# EAGLE design shield_007 (EAGLE 7.3.0)
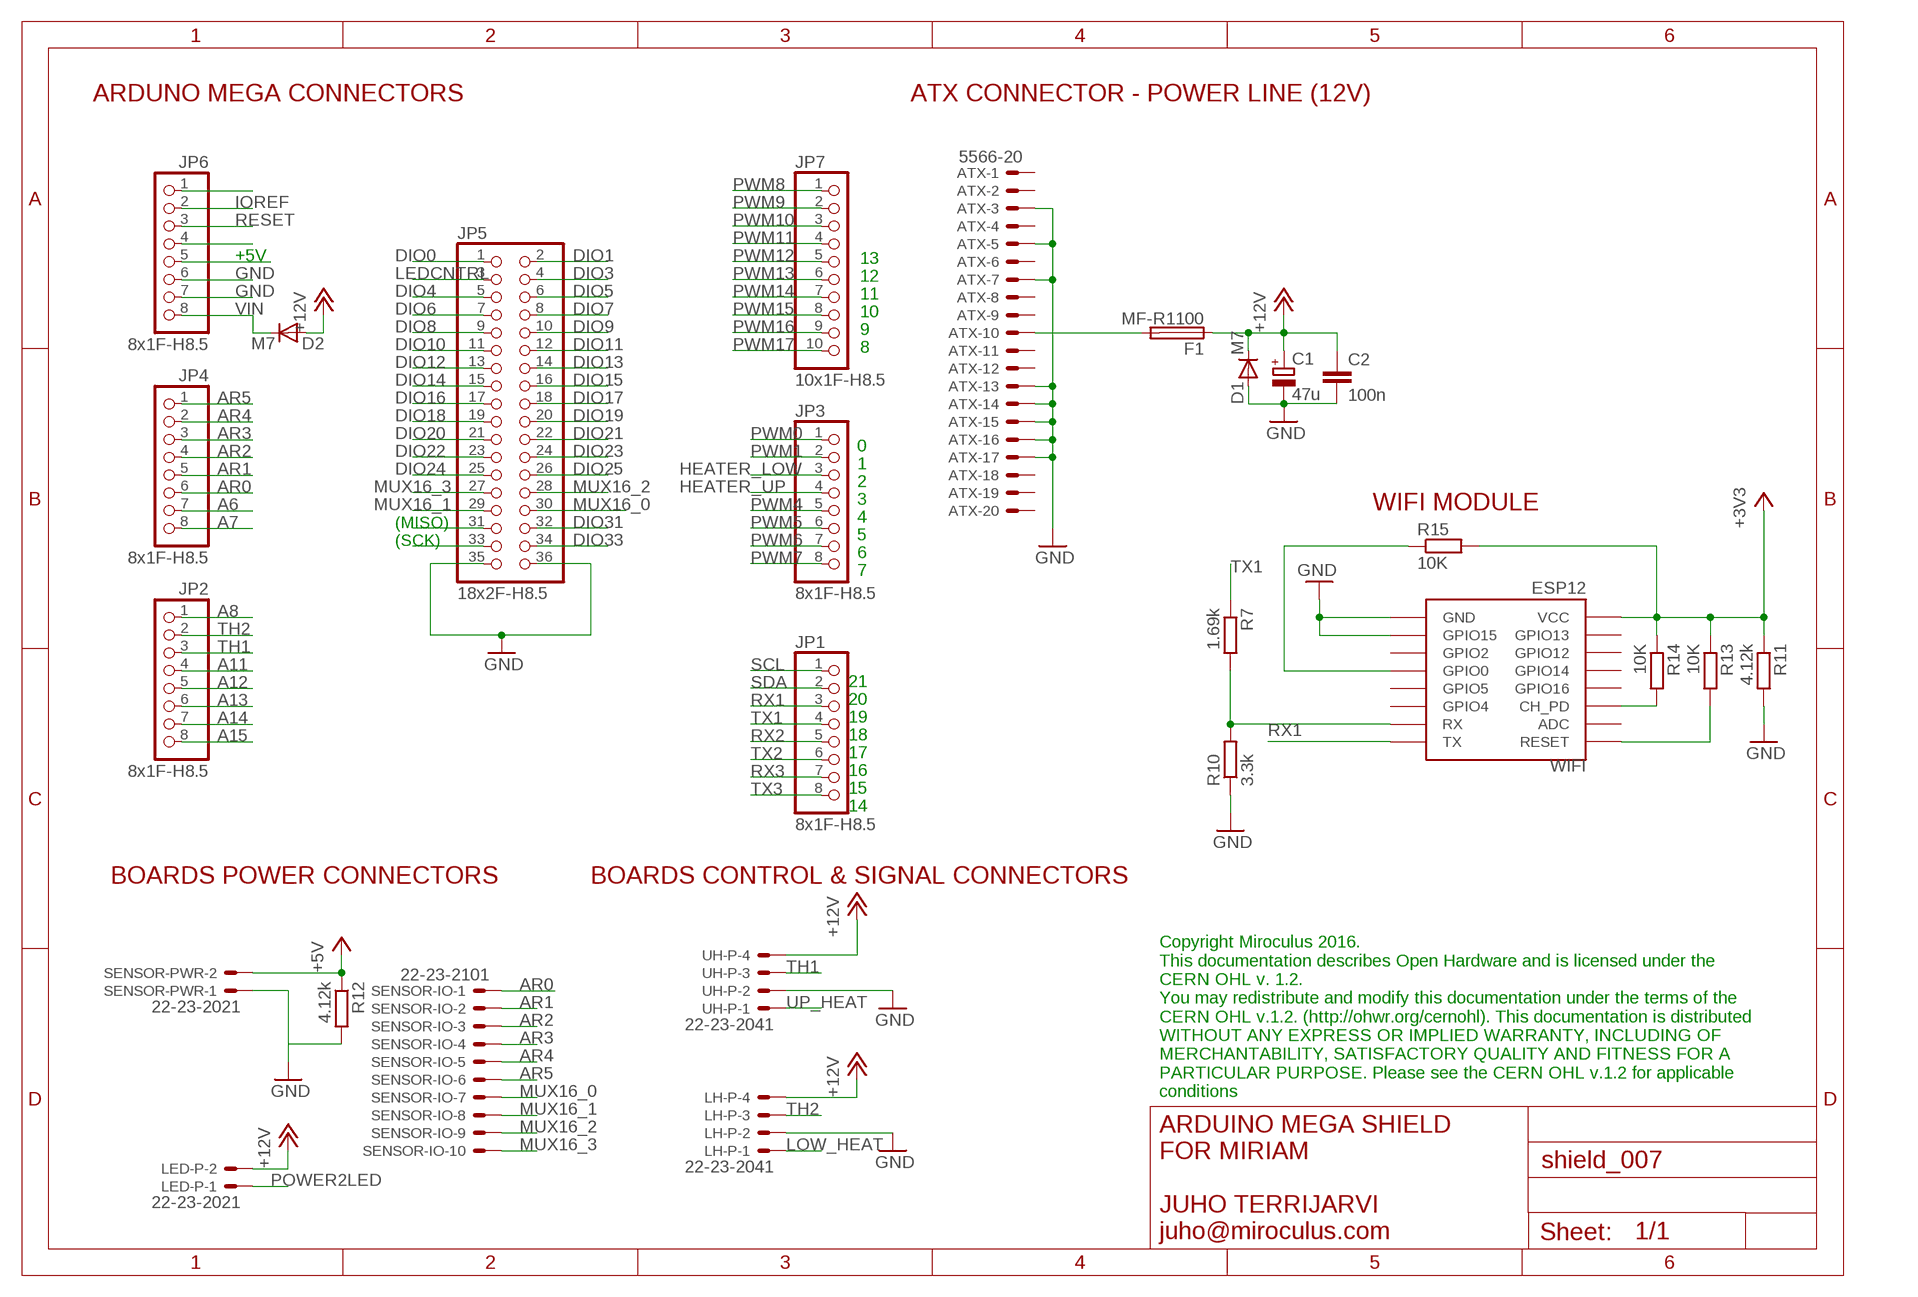
[diagram p0: schematic, sheet 1, part 1 of 2]
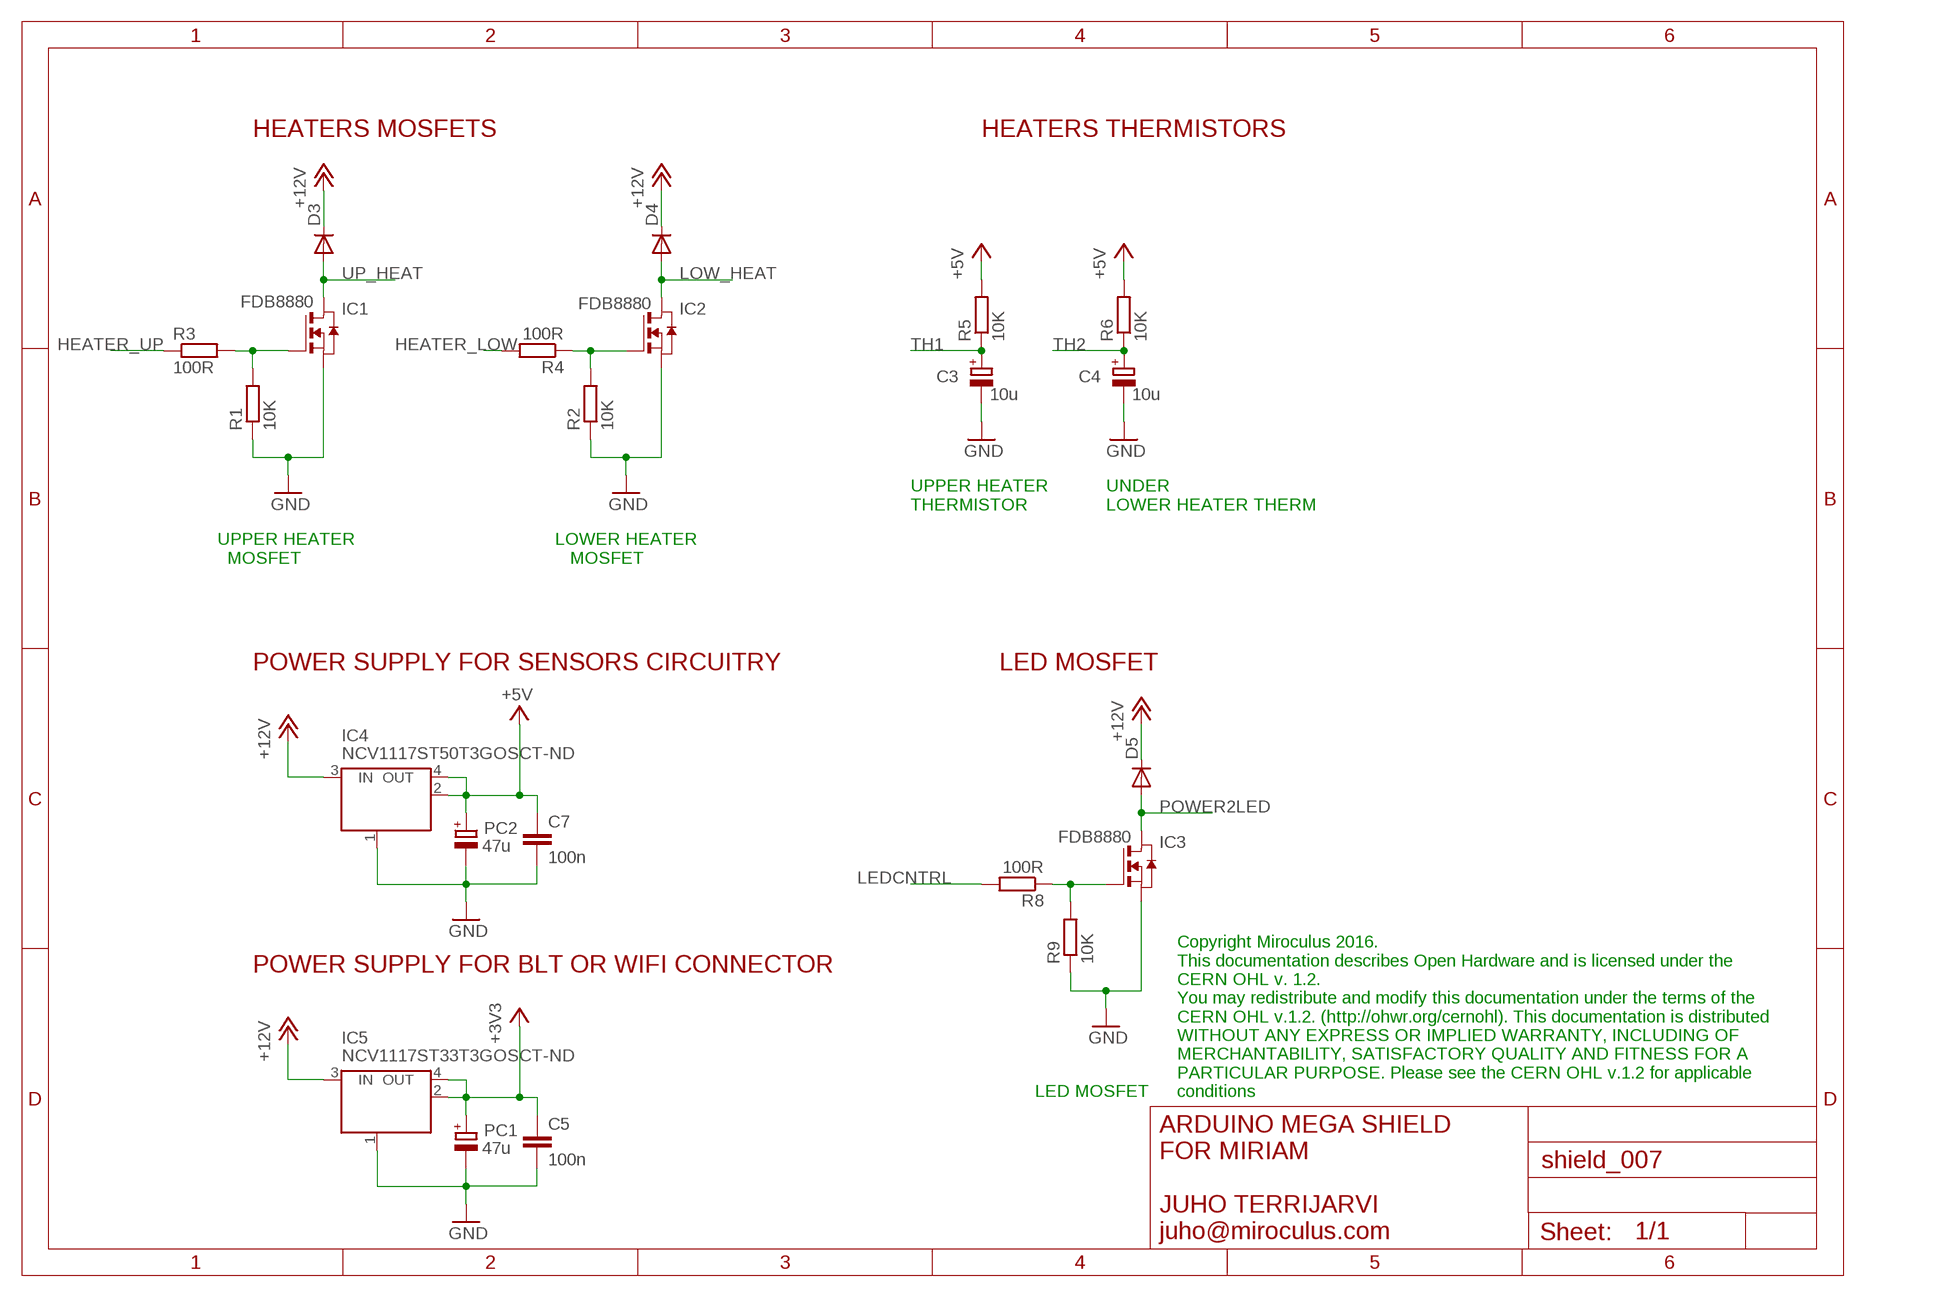
[diagram p1: schematic, sheet 1, part 2 of 2]

## Parts
ATX  5566-20  [5566-20]
C1  47u  CPOL-EUD  [PANASONIC_D]
C2  100n  C-EUC0603  [C0603]
C3  10u  CPOL-EUA/3216-18R  [A/3216-18R]
C4  10u  CPOL-EUA/3216-18R  [A/3216-18R]
C5  100n  C-EUC0603  [C0603]
C7  100n  C-EUC0603  [C0603]
D1  M7  DIODE-SMB  [SMB]
D2  M7  DIODE-SMB  [SMB]
D3  RGL34A  DO-213_DIODE  [DO-213AA_DIODE]
D4  RGL34A  DO-213_DIODE  [DO-213AA_DIODE]
D5  RGL34A  DO-213_DIODE  [DO-213AA_DIODE]
F1  MF-R1100  LITTLEFUSE  [LITTLEFUSE]
IC1  FDB8880  [FDB8880]
IC2  FDB8880  [FDB8880]
IC3  FDB8880  [FDB8880]
IC4  NCV1117ST50T3GOSCT-ND  MC33269ST-3.3T3  [SOT223]
IC5  NCV1117ST33T3GOSCT-ND  MC33269ST-3.3T3  [SOT223]
JP1  8x1F-H8.5  PINHD-1X8  [1X08]
JP2  8x1F-H8.5  PINHD-1X8  [1X08]
JP3  8x1F-H8.5  PINHD-1X8  [1X08]
JP4  8x1F-H8.5  PINHD-1X8  [1X08]
JP5  18x2F-H8.5  PINHD-2X18  [2X18]
JP6  8x1F-H8.5  PINHD-1X8  [1X08]
JP7  10x1F-H8.5  PINHD-1X10_ARD  [1X10]
LED-P  22-23-2021  [22-23-2021]
LH-P  22-23-2041  [22-23-2041]
PC1  47u  CPOL-EUD  [PANASONIC_D]
PC2  47u  CPOL-EUD  [PANASONIC_D]
R1  10K  R-EU_R0603  [R0603]
R2  10K  R-EU_R0603  [R0603]
R3  100R  R-EU_R0603  [R0603]
R4  100R  R-EU_R0603  [R0603]
R5  10K  R-EU_R0603  [R0603]
R6  10K  R-EU_R0603  [R0603]
R7  1.69k  R-EU_R0603  [R0603]
R8  100R  R-EU_R0603  [R0603]
R9  10K  R-EU_R0603  [R0603]
R10  3.3k  R-EU_R0603  [R0603]
R11  4.12k  R-EU_R0603  [R0603]
R12  4.12k  R-EU_R0603  [R0603]
R13  10K  R-EU_R0603  [R0603]
R14  10K  R-EU_R0603  [R0603]
R15  10K  R-EU_R0603  [R0603]
SENSOR-IO  22-23-2101  [22-23-2101]
SENSOR-PWR  22-23-2021  [22-23-2021]
UH-P  22-23-2041  [22-23-2041]
WIFI  ESP12  [ESP12]

## Nets
+3V3 [power usb]: C5.1 IC5.2(OUT) IC5.4(OUT) PC1.+ R11.1 R13.1 R14.1 R15.2 WIFI.VCC
+5V: C7.1 IC4.2(OUT) IC4.4(OUT) PC2.+ R5.2 R6.2 R12.1 SENSOR-PWR.2
+12V [power12]: C1.+ C2.1 D1.C D2.A D3.P$2(C) D4.P$2(C) D5.P$2(C) F1.1 IC4.3(IN) IC5.3(IN) LED-P.2 LH-P.4 UH-P.4
A6: JP4.7
A7: JP4.8
A8: JP2.1
A11: JP2.4
A12: JP2.5
A13: JP2.6
A14: JP2.7
A15: JP2.8
AR0: JP4.6 SENSOR-IO.1
AR1: JP4.5 SENSOR-IO.2
AR2: JP4.4 SENSOR-IO.3
AR3: JP4.3 SENSOR-IO.4
AR4: JP4.2 SENSOR-IO.5
AR5: JP4.1 SENSOR-IO.6
DIO0: JP5.1
DIO1: JP5.2
DIO3: JP5.4
DIO4: JP5.5
DIO5: JP5.6
DIO6: JP5.7
DIO7: JP5.8
DIO8: JP5.9
DIO9: JP5.10
DIO10: JP5.11
DIO11: JP5.12
DIO12: JP5.13
DIO13: JP5.14
DIO14: JP5.15
DIO15: JP5.16
DIO16: JP5.17
DIO17: JP5.18
DIO18: JP5.19
DIO19: JP5.20
DIO20: JP5.21
DIO21: JP5.22
DIO22: JP5.23
DIO23: JP5.24
DIO24: JP5.25
DIO25: JP5.26
DIO30: JP5.31
DIO31: JP5.32
DIO32: JP5.33
DIO33: JP5.34
GND [gnd]: ATX.3 ATX.5 ATX.7 ATX.13 ATX.14 ATX.15 ATX.16 ATX.17 C1.- C2.2 C3.- C4.- C5.2 C7.2 D1.A IC1.3(S) IC2.3(S) IC3.3(S) IC4.1(GND/ADJ) IC5.1(GND/ADJ) JP5.35 JP5.36 JP6.6 JP6.7 LH-P.2 PC1.- PC2.- R1.1 R2.1 R9.1 R10.1 R11.2 R12.2 SENSOR-PWR.1 UH-P.2 WIFI.GND WIFI.GPIO15
HEATER_LOW: JP3.3 R4.2
HEATER_UP: JP3.4 R3.1
IOREF: JP6.2
LEDCNTRL: JP5.3 R8.2
LOW_HEAT [power12]: D4.P$1(A) IC2.2(D) LH-P.1
MUX16_0: JP5.30 SENSOR-IO.7
MUX16_1: JP5.29 SENSOR-IO.8
MUX16_2: JP5.28 SENSOR-IO.9
MUX16_3: JP5.27 SENSOR-IO.10
N$1: JP6.1
N$2: JP6.5
N$4: IC3.1(G) R8.1 R9.2
N$5: R7.2 R10.2 WIFI.RX
N$6: JP6.4
N$10: R13.2 WIFI.RESET
N$11 [power usb]: R14.2 WIFI.CH_PD
N$13: R15.1 WIFI.GPIO0
N$17 [power12]: ATX.10 F1.2
N$18: IC1.1(G) R1.2 R3.2
N$19: IC2.1(G) R2.2 R4.1
POWER2LED [power12]: D5.P$1(A) IC3.2(D) LED-P.1
PWM0: JP3.1
PWM1: JP3.2
PWM4: JP3.5
PWM5: JP3.6
PWM6: JP3.7
PWM7: JP3.8
PWM8: JP7.1
PWM9: JP7.2
PWM10: JP7.3
PWM11: JP7.4
PWM12: JP7.5
PWM13: JP7.6
PWM14: JP7.7
PWM15: JP7.8
PWM16: JP7.9
PWM17: JP7.10
RESET: JP6.3
RX1: JP1.3 WIFI.TX
RX2: JP1.5
RX3: JP1.7
SCL: JP1.1
SDA: JP1.2
TH1: C3.+ JP2.3 R5.1 UH-P.3
TH2: C4.+ JP2.2 LH-P.3 R6.1
TX1: JP1.4 R7.1
TX2: JP1.6
TX3: JP1.8
UP_HEAT [power12]: D3.P$1(A) IC1.2(D) UH-P.1
VIN: D2.C JP6.8
Unconnected: ATX.1 ATX.2 ATX.4 ATX.6 ATX.8 ATX.9 ATX.11 ATX.12 ATX.18 ATX.19 ATX.20 WIFI.ADC WIFI.GPIO2 WIFI.GPIO4 WIFI.GPIO5 WIFI.GPIO12 WIFI.GPIO13 WIFI.GPIO14 WIFI.GPIO16

## Notes on the sheet
- ARDUNO MEGA CONNECTORS | ATX CONNECTOR - POWER LINE (12V)
- HEATERS MOSFETS | HEATERS THERMISTORS
- +5V | 13
- 12
- 11
- 10
- 9
- 8
- 0
- 1
- 2
- 3
- 4 | WIFI MODULE
- UPPER HEATER
  THERMISTOR
- UNDER
  LOWER HEATER THERM
- (MISO) | 5
- (SCK) | 6
- 7
- UPPER HEATER
    MOSFET
- LOWER HEATER
     MOSFET
- 21 | POWER SUPPLY FOR SENSORS CIRCUITRY | LED MOSFET
- 20
- 19
- 18
- 17
- 16
- 15
- 14
- BOARDS POWER CONNECTORS | BOARDS CONTROL & SIGNAL CONNECTORS
- POWER SUPPLY FOR BLT OR WIFI CONNECTOR
- Copyright Miroculus 2016.
  This documentation describes Open Hardware and is licensed under the
  CERN OHL v. 1.2.
  You may redistribute and modify this documentation under the terms of the
  CERN OHL v.1.2. (http://ohwr.org/cernohl). This documentation is distributed
  WITHOUT ANY EXPRESS OR IMPLIED WARRANTY, INCLUDING OF
  MERCHANTABILITY, SATISFACTORY QUALITY AND FITNESS FOR A
  PARTICULAR PURPOSE. Please see the CERN OHL v.1.2 for applicable
  conditions
- LED MOSFET
- Copyright Miroculus 2016.
  This documentation describes Open Hardware and is licensed under the
  CERN OHL v. 1.2.
  You may redistribute and modify this documentation under the terms of the
  CERN OHL v.1.2. (http://ohwr.org/cernohl). This documentation is distributed
  WITHOUT ANY EXPRESS OR IMPLIED WARRANTY, INCLUDING OF
  MERCHANTABILITY, SATISFACTORY QUALITY AND FITNESS FOR A
  PARTICULAR PURPOSE. Please see the CERN OHL v.1.2 for applicable
  conditions
- ARDUINO MEGA SHIELD
  FOR MIRIAM
  
  JUHO TERRIJARVI
  juho@miroculus.com
- ARDUINO MEGA SHIELD
  FOR MIRIAM
  
  JUHO TERRIJARVI
  juho@miroculus.com

## Library data of the parts
ATX = con-molex:5566-20: Mini FIT connector 20 pol ATX PC-Motherboard Power connector Source: http://www.molex.com; OC_FARNELL: 9734252; OC_NEWARK: unknown
C1 C3 C4 PC1 PC2 = rcl:CPOL-EU: POLARIZED CAPACITOR, European symbol
C2 C5 C7 = rcl:C-EU: CAPACITOR, European symbol
D1 D2 = diode:DIODE-: DIODE
D3-D5 = verkstad:DO-213_DIODE: RGL34A thru RGL34K Surface Mount Glass Passivated Junction Fast Switching Rectifier
F1 = fuse:LITTLEFUSE: LITTLEFUSE Picofuse/slow Littlefuse; FARNELL: 1652183; OC_FARNELL: unknown; OC_NEWARK: unknown
IC1-IC3 = verkstad:FDB8880: FDB8880 N-Channel PowerTrench MOSFET This N-Channel MOSFET has been designed specifically to improve the overall efficiency of DC/DC converters using either synchronous or conventional switching PWM controllers. It has been optimized for low gate charge, low rDS(ON) and fast switching speed. Digikey Part Number: FDD8880CT-ND
IC4 IC5 = linear:MC33269ST*: Adjustable Output Low Dropout Voltage Regulator 800 mA Source: http://www.onsemi.com/pub/Collateral/MC33269-D.PDF
JP1-JP4 JP6 = SmartPrj:PINHD-1X8: PIN HEADER
JP5 = SmartPrj:PINHD-2X18: PIN HEADER
JP7 = SmartPrj:PINHD-1X10_ARD: PIN HEADER
LED-P SENSOR-PWR = con-molex:22-23-2021: .100" (2.54mm) Center Header - 2 Pin; MF: MOLEX; MPN: 22-23-2021; OC_FARNELL: 1462926; OC_NEWARK: 25C3832
LH-P UH-P = con-molex:22-23-2041: .100" (2.54mm) Center Header - 4 Pin; MF: MOLEX; MPN: 22-23-2041; OC_FARNELL: 1462920; OC_NEWARK: 38C0355
R1-R15 = rcl:R-EU_: RESISTOR, European symbol
SENSOR-IO = con-molex:22-23-2101: .100" (2.54mm) Center Header - 10 Pin; MF: MOLEX; MPN: 22-23-2101; OC_FARNELL: 1756828; OC_NEWARK: 94C0765
WIFI = esp8266modules:ESP12: ESP8266 Wifi module 12

## Net classes
0 default: width 0.254 mm, drill 0.406 mm, clearance 0.203 mm
1 power: width 0.61 mm, drill 0.406 mm, clearance 0.203 mm
2 gnd: width 0.305 mm, drill 0.406 mm, clearance 0.203 mm
3 power usb: width 0.508 mm, drill 0.406 mm, clearance 0.203 mm
4 power12: width 1.905 mm, drill 0.813 mm, clearance 0.203 mm

## Board
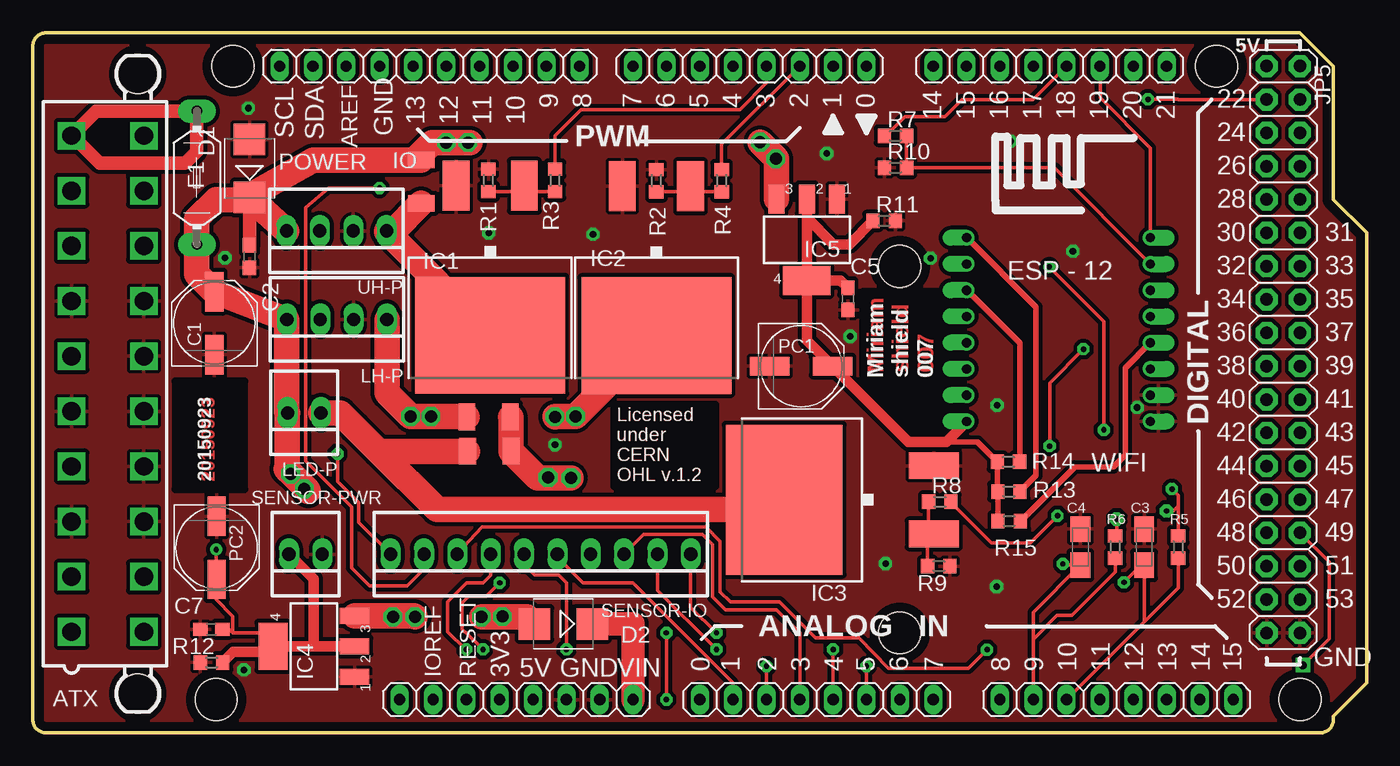
[diagram p2: board, top side]
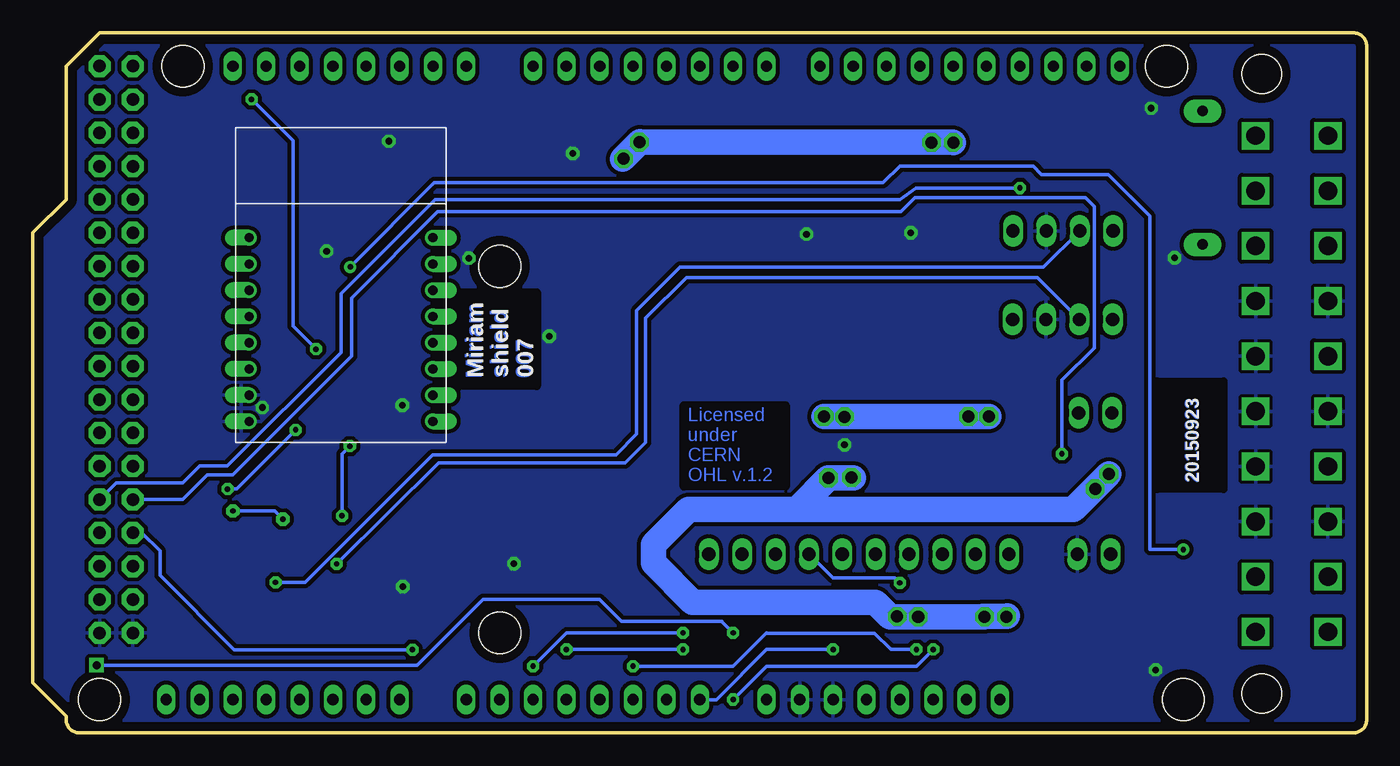
[diagram p3: board, bottom side, seen from below]

Size 101.6 x 53.34 mm. Coordinates in mm from the lower left corner, seen from the top.
Outline: 96.52,53.34 99.06,50.8 99.06,40.64 101.6,38.1 101.6,3.81 99.06,1.27 99.06,1 arc-90 98.06,0 1,0 arc-90 0,1 0,52.34 arc-90 1,53.34 96.52,53.34
Copper layers (1*16): Top 0.035mm / dielectric 1.5mm / Bottom 0.035mm
Design rules "default": minimum track width 8mil, minimum drill 16mil, track to track 7mil, track to pad 7mil, pad to pad 8mil, via to via 10mil, smd to smd 7mil, copper to edge 27mil, drill to drill 12mil, minimum pad ring 10mil, minimum via ring 10mil, stop-mask expansion 2mil, vias tented up to drill 24mil, thermal gap 10mil
Holes 3.2 mm at 96.52,2.54 15.24,50.8 90.17,50.8 13.97,2.54 66.04,35.56 66.04,7.62
tRestrict: area 10.9,18.6 to 16.1,26.8; area 63.2,26.5 to 69.1,33.6; area 44.3,18.8 to 52,25
bRestrict: area 10.9,18.6 to 16,26.8; area 63.2,26.4 to 69.1,33.6; area 44.2,18.8 to 52,25

### Footprints (pad centres in the part's own frame; a part is rotated, then mirrored left to right if it is on the bottom)
5566-20 = drill 1.4 square: 1 18.9,-2.75; 2 14.7,-2.75; 3 10.5,-2.75; 4 6.3,-2.75; 5 2.1,-2.75; 6 -2.1,-2.75; 7 -6.3,-2.75; 8 -10.5,-2.75; 9 -14.7,-2.75; 10 -18.9,-2.75; 11 18.9,2.75; 12 14.7,2.75; 13 10.5,2.75; 14 6.3,2.75; 15 2.1,2.75; 16 -2.1,2.75; 17 -6.3,2.75; 18 -10.5,2.75; 19 -14.7,2.75; 20 -18.9,2.75 | hole 3: 23.6,2.29; -23.6,2.29
PANASONIC_D = smd 3 x 1.4: + 2.4,0; - -2.4,0
C0603 = smd 1.1 x 1: 1 -0.85,0; 2 0.85,0
A/3216-18R = smd 1.95 x 1.5: + 1.375,0; - -1.375,0
SMB = smd 2.4 x 2.4: A 2.2,0; C -2.2,0
DO-213AA_DIODE = smd 1.27 x 2.032: P$1 -1.651,0; P$2 1.651,0
LITTLEFUSE = drill 0.813 pad 1.778 long: 1 -5.08,0; 2 5.08,0
FDB8880 = smd 2.032 x 3.81: 1 -2.595,-8.89; 3 2.595,-8.89 | smd 11.43 x 8.89: 2 0,2.5
SOT223 = smd 1.219 x 2.235: 1 -2.311,-3.099; 2 0,-3.099; 3 2.311,-3.099 | smd 3.6 x 2.2: 4 0,3.099
1X08 = drill 0.85 pad 1.422 long: 1 -8.89,0; 2 -6.35,0; 3 -3.81,0; 4 -1.27,0; 5 1.27,0; 6 3.81,0; 7 6.35,0; 8 8.89,0
2X18 = drill 0.95 pad 1.676 octagon: 1 -21.59,-1.27; 2 -21.59,1.27; 3 -19.05,-1.27; 4 -19.05,1.27; 5 -16.51,-1.27; 6 -16.51,1.27; 7 -13.97,-1.27; 8 -13.97,1.27; 9 -11.43,-1.27; 10 -11.43,1.27; 11 -8.89,-1.27; 12 -8.89,1.27; 13 -6.35,-1.27; 14 -6.35,1.27; 15 -3.81,-1.27; 16 -3.81,1.27; 17 -1.27,-1.27; 18 -1.27,1.27; 19 1.27,-1.27; 20 1.27,1.27; 21 3.81,-1.27; 22 3.81,1.27; 23 6.35,-1.27; 24 6.35,1.27; 25 8.89,-1.27; 26 8.89,1.27; 27 11.43,-1.27; 28 11.43,1.27; 29 13.97,-1.27; 30 13.97,1.27; 31 16.51,-1.27; 32 16.51,1.27; 33 19.05,-1.27; 34 19.05,1.27; 35 21.59,-1.27; 36 21.59,1.27
1X10 = drill 0.85 pad 1.422 long: 1 -11.43,0; 2 -8.89,0; 3 -6.35,0; 4 -3.81,0; 5 -1.27,0; 6 1.27,0; 7 3.81,0; 8 6.35,0; 9 8.89,0; 10 11.43,0
22-23-2021 = drill 1 long: 1 -1.27,0; 2 1.27,0
22-23-2041 = drill 1 long: 1 -3.81,0; 2 -1.27,0; 3 1.27,0; 4 3.81,0
R0603 = smd 1 x 1.1: 1 -0.85,0; 2 0.85,0
22-23-2101 = drill 1 long: 1 -11.43,0; 2 -8.89,0; 3 -6.35,0; 4 -3.81,0; 5 -1.27,0; 6 1.27,0; 7 3.81,0; 8 6.35,0; 9 8.89,0; 10 11.43,0
ESP12 = drill 0.7 offset: ADC -7.1,3.8; CH_PD -7.1,1.8; GND 6.9,-8.2; GPIO0 6.9,-2.2; GPIO2 6.9,-4.2; GPIO4 6.9,1.8; GPIO5 6.9,-0.2; GPIO12 -7.1,-4.2; GPIO13 -7.1,-6.2; GPIO14 -7.1,-2.2; GPIO15 6.9,-6.2; GPIO16 -7.1,-0.2; RESET -7.1,5.8; RX 6.9,3.8; TX 6.9,5.8; VCC -7.1,-8.2

### Placement (x,y rotation side)
ATX  5.7,26.6 270 top
C1  13.83,31.22 90 top
C2  16.5,36.3 270 top
C3  84.65,14.16 270 top
C4  79.79,14.16 270 top
C5  62.08,33.07 270 top
C7  13.6,7.9 180 top
D1  16.5,43 90 top
D2  40.4,8.3 180 top
D3  29.59,42 90 top
D4  34.72,24.06 0 top
D5  34.77,21.46 0 top
F1  12.5,42.3 90 top
IC1  34.84,32.79 180 top
IC2  47.5,32.77 180 top
IC3  59.74,17.76 90 top
IC4  21.4,6.6 90 top
IC5  58.95,37.57 180 top
JP1  77.47,50.8 180 top
JP2  82.55,2.54 0 top
JP3  54.61,50.8 180 top
JP4  59.69,2.54 0 top
JP5  95.25,29.21 270 top
JP6  36.83,2.54 0 top
JP7  30.23,50.8 0 top
LED-P  20.67,24.38 180 top
LH-P  23.16,31.5 180 top
PC1  58.52,27.94 0 top
PC2  14,14.1 270 top
R1  34.71,42.1 270 top
R2  47.5,42.07 270 top
R3  39.78,42.1 270 top
R4  52.47,42.07 90 top
R5  87.25,14.16 90 top
R6  82.44,14.16 90 top
R7  65.71,45.49 0 top
R8  69.09,17.6 0 top
R9  69.01,12.7 180 top
R10  65.71,43.05 0 top
R11  64.85,39.01 0 top
R12  13.61,5.36 180 top
R13  74.35,18.39 0 top
R14  74.32,20.65 0 top
R15  74.37,16.13 180 top
SENSOR-IO  38.68,13.62 180 top
SENSOR-PWR  20.78,13.61 180 top
UH-P  23.13,38.25 180 top
WIFI  78.23,31.93 0 top

### Tracks (layer width: path | path; a pad name or v marks a point on that pad's centre or on a via)
+3V3
  Top 0.406: 68.71,22.17 71.95,22.17 R14.1 73.47,18.41 R13.1 73.5,16.15 R15.2
  Top 0.813: IC5.2 58.95,39.24 | 58.95,39.24 IC5.4 | IC5.4 61.53,34.47 C5.1 | IC5.4 58.95,29.91 PC1.+ 66.69,22.17 68.71,22.17 69.58,22.17 WIFI.VCC | R11.1 62.19,37.21 60.98,37.21 58.95,39.24
+5V  (via drill 0.41, 0.41 pad 1.02)
  Top 0.203: 13.97,11.43 PC2.+
  Top 0.254: 13.97,11.43 13.97,10.16 15.24,8.89 15.24,7.62 | 19.05,5.08 17.78,5.08 17.78,6.17 17.78,6.35 IC4.4 17.78,7.62 15.24,7.62 | 24.13,6.35 IC4.2 | v13.97,13.97 13.97,12.06 PC2.+ | 15.24,7.62 14.96,7.9 C7.1 | 87.25,15.35 R5.2 87.25,17.28 | v86.77,18.58 87.25,18.1 87.25,17.28 | 87.25,17.28 86.88,16.91 v86.35,16.91 | v81.58,23.09 81.58,31.35 v77.42,35.51 | v82.56,16.29 82.56,15.13 R6.2
  Top 0.813: 24.13,6.35 23.88,6.6 21.39,6.6 | 21.39,6.6 IC4.4 | SENSOR-PWR.2 21.39,11.73 21.39,6.6 | R12.1 15.28,6.17 17.78,6.17
  Bottom 0.254: v13.97,13.97 16.51,13.97 16.51,39.37 19.68,42.55 24.77,42.55 25.4,43.18 35.56,43.18 36.83,41.91 71.02,41.91 v77.42,35.51 | v81.58,23.09 86.09,18.58 v86.77,18.58 | v86.35,16.91 83.18,16.91 v82.56,16.29
+12V  (via drill 0.91)
  Top 0.305: 19.36,20.02 19.41,20.02 19.66,19.76 | 33.27,44.96 32.28,44.96 32.23,45.01 31.52,45.01 v31.5,44.98 v33.15,44.98 | 56.64,43.76 56.57,43.76 | 56.57,43.76 55.83,44.5 | 56.57,43.76 v56.59,43.74 | 20.95,18.47 20.8,18.47 v20.68,18.59 | v39.24,19.46 39.83,19.46 39.85,19.43
  Top 0.813: v19.63,19.74 19.36,20.02
  Top 1.016: C2.1 D1.C
  Top 1.905: 13.97,40.64 16,40.64 16.51,40.64 D1.C
  Top 1.93: 13.97,40.64 12.5,39.17 F1.1 12.5,34.95 C1.+ LH-P.4 19.35,24.43 LED-P.2 19.36,24.34 19.36,20.02 | D3.P$2 29.08,43.65 | 29.08,43.65 21.35,43.65 16,40.64 | UH-P.4 D1.C | v29.11,8.84 29.04,8.91 IC4.3 | 19.3,20.12 19.66,19.76 20.95,18.47 20.95,18.41 | D2.A 37.66,8.84 v34.16,8.84 | D4.P$2 36.42,24.01 D5.P$2 38.45,19.43 39.85,19.43 v41,19.43 | IC5.3 56.64,43.76 v55.4,45.01 | v31.5,44.98 30.41,44.98 29.08,43.65 | 31.52,44.96 33.27,44.96 33.3,44.98
  Bottom 0.305: 55.35,45.06 55.35,44.98 v56.59,43.74
  Bottom 0.406: v29.11,8.84 29.08,8.87 | 27.41,8.87 v27.43,8.84 | 36.3,8.84 36.27,8.87 v35.76,8.87
  Bottom 1.93: v19.63,19.74 22.33,17.04 43.38,17.04 | 43.38,17.04 51.64,17.04 54.33,14.35 54.33,12.95 51.33,9.96 37.41,9.96 36.3,8.84 v34.16,8.84 | v34.16,8.84 v29.11,8.84 | 27.36,8.91 27.41,8.87 29.08,8.87 29.23,8.87 | v34.16,8.84 34.19,8.84 | v41,19.43 43.38,17.04 | v55.4,45.01 31.52,45.01 v31.5,44.98 | 55.35,45.06 56.69,43.71
AR0  (via drill 0.41)
  Top 0.254: v63.5,5.08 JP4.6 | SENSOR-IO.1 50.11,9.58 v52.07,7.62
  Bottom 0.254: v63.5,5.08 60.96,7.62 v52.07,7.62
AR1  (via drill 0.41)
  Top 0.254: v60.96,6.35 JP4.5 | v52.07,6.35 49.94,8.48 49.53,8.89 47.57,10.85 SENSOR-IO.2
  Bottom 0.254: v52.07,6.35 v60.96,6.35
AR2
  Top 0.254: JP4.4 58.42,7.62 56.66,9.38 52.75,9.38 51.77,10.36 51.77,14.36 51.01,15.12 46.53,15.12 SENSOR-IO.3
AR3  (via drill 0.41)
  Top 0.254: v55.88,5.08 JP4.3 | v35.56,11.43 34.53,10.4 33.2,10.4 32.7,9.9 32.7,7.9 32.9,7.7 32.94,7.7 v34.29,6.35
  Bottom 0.254: v55.88,5.08 48.26,5.08 45.72,7.62 45.7,7.6 37.5,7.6 36.25,6.35 v34.29,6.35 | v35.56,11.43 35.93,11.8 40.67,11.8 SENSOR-IO.4
AR4
  Top 0.254: JP4.2 53.34,3.81 45.72,11.43 41.91,11.43 39.95,13.39 SENSOR-IO.5
AR5  (via drill 0.41)
  Top 0.254: v40.64,6.35 40.64,11.43 40.03,12.04 38.2,12.04 37.41,12.83 SENSOR-IO.6
  Bottom 0.254: JP4.1 49.53,2.54 45.72,6.35 v40.64,6.35
GND  (via drill 0.5 pad 0.41)
  other vias: 14.63,36.2 34.72,38.1 60.48,44.15 62.26,30.23 16.41,47.6 39.78,21.95 16.08,4.8 73.41,11.15 64.95,12.9 42.67,38 73.46,24.97 68.38,36.17 74.47,45.09 84.12,24.79 79.22,36.7
  pour Top (isolate 0.305, rank 2): 0.64,52.7 101.6,52.7 101.6,0.64 0.64,0.64 0.64,29.84 0.59,28.75 0.59,45.85 0.64,46.35
  pour Bottom (isolate 0.305, rank 2): 0.64,52.7 101.6,52.7 102.23,52.07 102.23,0.64 1.27,0.64 0.64,1.27 0.64,29.84 0.49,29.84 0.59,45.76 0.64,46.35
HEATER_LOW
  Top 0.254: R4.2 52.47,44.84 JP3.3
HEATER_UP
  Top 0.254: JP3.4 55.88,49.53 53.85,47.5 41.76,47.5 39.78,45.52 R3.1
LEDCNTRL  (via drill 0.41)
  Top 0.254: v80.03,29.23 77.45,26.65 v77.45,21.85 | v78.05,16.54 76,14.49 73,14.49 69.94,17.55 R8.2 | JP5.3 87.25,48.26 87.22,48.27 v84.94,48.27
  Bottom 0.254: v77.45,21.85 78.05,21.25 v78.05,16.54 | v80.03,29.23 81.79,30.99 81.79,45.12 v84.94,48.27
LOW_HEAT  (via drill 0.91)
  Top 1.93: LH-P.1 26.97,25.91 v28.78,24.11 v30.33,24.11 33.03,24.11 D4.P$1 | IC2.2 v41.34,24.11 39.79,24.11 v39.76,24.08
  Bottom 1.93: v28.78,24.11 v41.34,24.11
MUX16_0  (via drill 0.41, 0.6)
  Top 0.254: v48.26,7.62 v48.26,2.54 | v33.02,6.35 32.95,6.35 31.6,7.7 31.6,10 33.03,11.43 34.29,11.43 34.87,12.01 SENSOR-IO.7 | JP5.30 98.75,13.01 98.75,7.16 v96.74,5.15
  Bottom 0.254: v33.02,6.35 34.29,5.08 45.72,5.08 v48.26,2.54 | v48.26,7.62 49.1,8.46 49.1,8.5 56.76,8.5 58.42,10.16 67.31,10.16 72.32,5.15 v96.74,5.15
MUX16_1  (via drill 0.41)
  Top 0.254: v72.69,6.34 71.27,4.92 65.17,4.92 62.93,7.23 59.62,7.25 56.89,9.98 53.14,10 52.33,10.73 52.33,14.59 51.28,15.7 34.22,15.7 SENSOR-IO.8
  Bottom 0.254: JP5.29 93.29,15.24 91.9,13.85 91.9,11.99 86.25,6.34 v72.69,6.34
MUX16_2  (via drill 0.41)
  Top 0.254: SENSOR-IO.9 29.79,12.49 28.5,11.2 25.65,11.2 24.28,12.57 24.28,17.22 20.78,20.73 20.78,40.03 22.52,41.52 v26.41,41.52
  Bottom 0.254: JP5.28 95.25,19.05 90.17,19.05 88.9,20.32 86.79,20.32 78.13,28.98 78.13,33.48 70.97,40.64 35.56,40.64 34.32,41.52 v26.41,41.52
MUX16_3  (via drill 0.41)
  Top 0.254: SENSOR-IO.10 24.82,16.05 24.82,17.58 23.22,19.18 v23.22,21.26
  Bottom 0.254: JP5.27 90.17,17.78 88.32,19.63 86.39,19.63 77.32,28.7 77.32,33.15 70.76,39.7 35.46,39.7 34.39,40.77 21.44,40.77 20.75,40.08 20.75,29.34 23.22,26.87 v23.22,21.26
N$3
  Top 1.016: 3,45.5 5.1,43.4 11.6,43.4 12.5,44.3 12.5,47.4
N$4
  Top 0.254: R9.2 68.13,12.73 68.13,14.69 68.61,15.16 IC3.1 68.63,15.23 68.21,15.65 68.21,17.57 R8.1
N$5
  Top 0.254: R7.2 R10.2 77.81,43.05 WIFI.RX
N$7
  Bottom 1.93: 42.14,18.34 41.05,19.43 39.09,19.43
N$10
  Top 0.406: R13.2 76.4,19.6 76.4,32.46 WIFI.RESET
N$11
  Top 0.406: R14.2 75.17,29.69 WIFI.CH_PD
N$13
  Top 0.406: R15.1 79.36,20.27 82.3,20.27 83.21,21.18 83.21,27.81 WIFI.GPIO0
N$17
  Top 1.016: ATX.10 4.83,47.38 F1.2
N$18
  Top 0.254: R1.2 R3.2 37.86,41.25 IC1.1
N$19
  Top 0.254: R2.2 49.66,41.22 49.73,41.3 | 49.73,41.3 IC2.1 | R4.1 49.81,41.22 49.73,41.3
POWER2LED
  Top 1.93: LED-P.1 23.42,24.38 24.52,23.28 26.35,21.46 | 26.35,21.46 30.79,17.02 56.5,17.02 IC3.2 | D5.P$1 26.35,21.46
RX1
  Top 0.254: JP1.3 81.3,50.78 81.3,48.4 85.13,44.57 WIFI.TX
TH1  (via drill 0.41)
  Top 0.254: JP2.3 84.65,8.45 | 84.65,8.45 87.25,11.05 R5.1 | 84.65,8.45 C3.+ 84.42,12.79 v83.11,11.47
  Bottom 0.254: UH-P.3 24.62,35.49 52.3,35.49 55.62,32.17 55.62,22.76 57.19,21.19 66.6,21.19 67.65,21.19 71.15,21.19 80.87,11.47 v83.11,11.47
TH2  (via drill 0.41)
  Top 0.254: JP2.2 76.2,7.14 | 76.2,7.14 76.2,9.2 C4.+ 78.56,12.79 v78.46,12.88 | R6.1 82.44,12.25 79.15,8.96 78.02,8.96 76.2,7.14
  Bottom 0.254: LH-P.3 25.1,34.71 51.82,34.71 54.94,31.59 54.94,22.13 56.51,20.56 65.97,20.56 66.38,20.56 70.71,20.56 78.41,12.93 v78.46,12.88
TX1
  Top 0.254: JP1.4 76.18,48.24 70.78,48.24 69.48,46.94 66.43,46.94 64.98,45.49 R7.1
UP_HEAT
  Top 1.93: 26.94,38.19 IC1.2 | UH-P.1 26.94,38.19 | 26.94,38.19 27.43,38.19 D3.P$1
VIN
  Top 1.778: D2.C 45.72,8.3 JP6.8

### Text on the board
Top: Miriam / shield / 007 | 20150923 | Licensed / under / CERN / OHL v.1.2
Bottom: Miriam / shield / 007 | 20150923 | Licensed / under / CERN / OHL v.1.2
tPlace: 9 | 8 | 7 | 6 | 5 | 4 | 3 | 2 | 1 | 0 | 22 | 14 | 15 | 16 | 17 | 18 | 19 | 20 | 21 | 13 | 12 | 11 | 10 | 24 | 26 | 28 | 30 | 31 | 32 | 33 | 34 | 35 | 36 | 37 | 38 | 39 | 40 | 41 | 42 | 43 | 44 | 45 | 46 | 47 | 48 | 49 | 50 | 51 | 52 | 53 | 0 | 1 | 2 | 3 | 4 | 5 | 6 | 7 | 8 | 9 | 10 | 11 | 12 | 13 | 14 | 15
tNames: 5V | SCL | SDA | AREF | GND | PWM | POWER | IO | Miriam / shield / 007 | DIGITAL | 20150923 | Licensed / under / CERN / OHL v.1.2 | ANALOG IN | GND | IOREF | RESET | 3V3 | 5V | GND | VIN
bNames: Miriam / shield / 007 | 20150923